# EAGLE design badge (EAGLE 5.11)
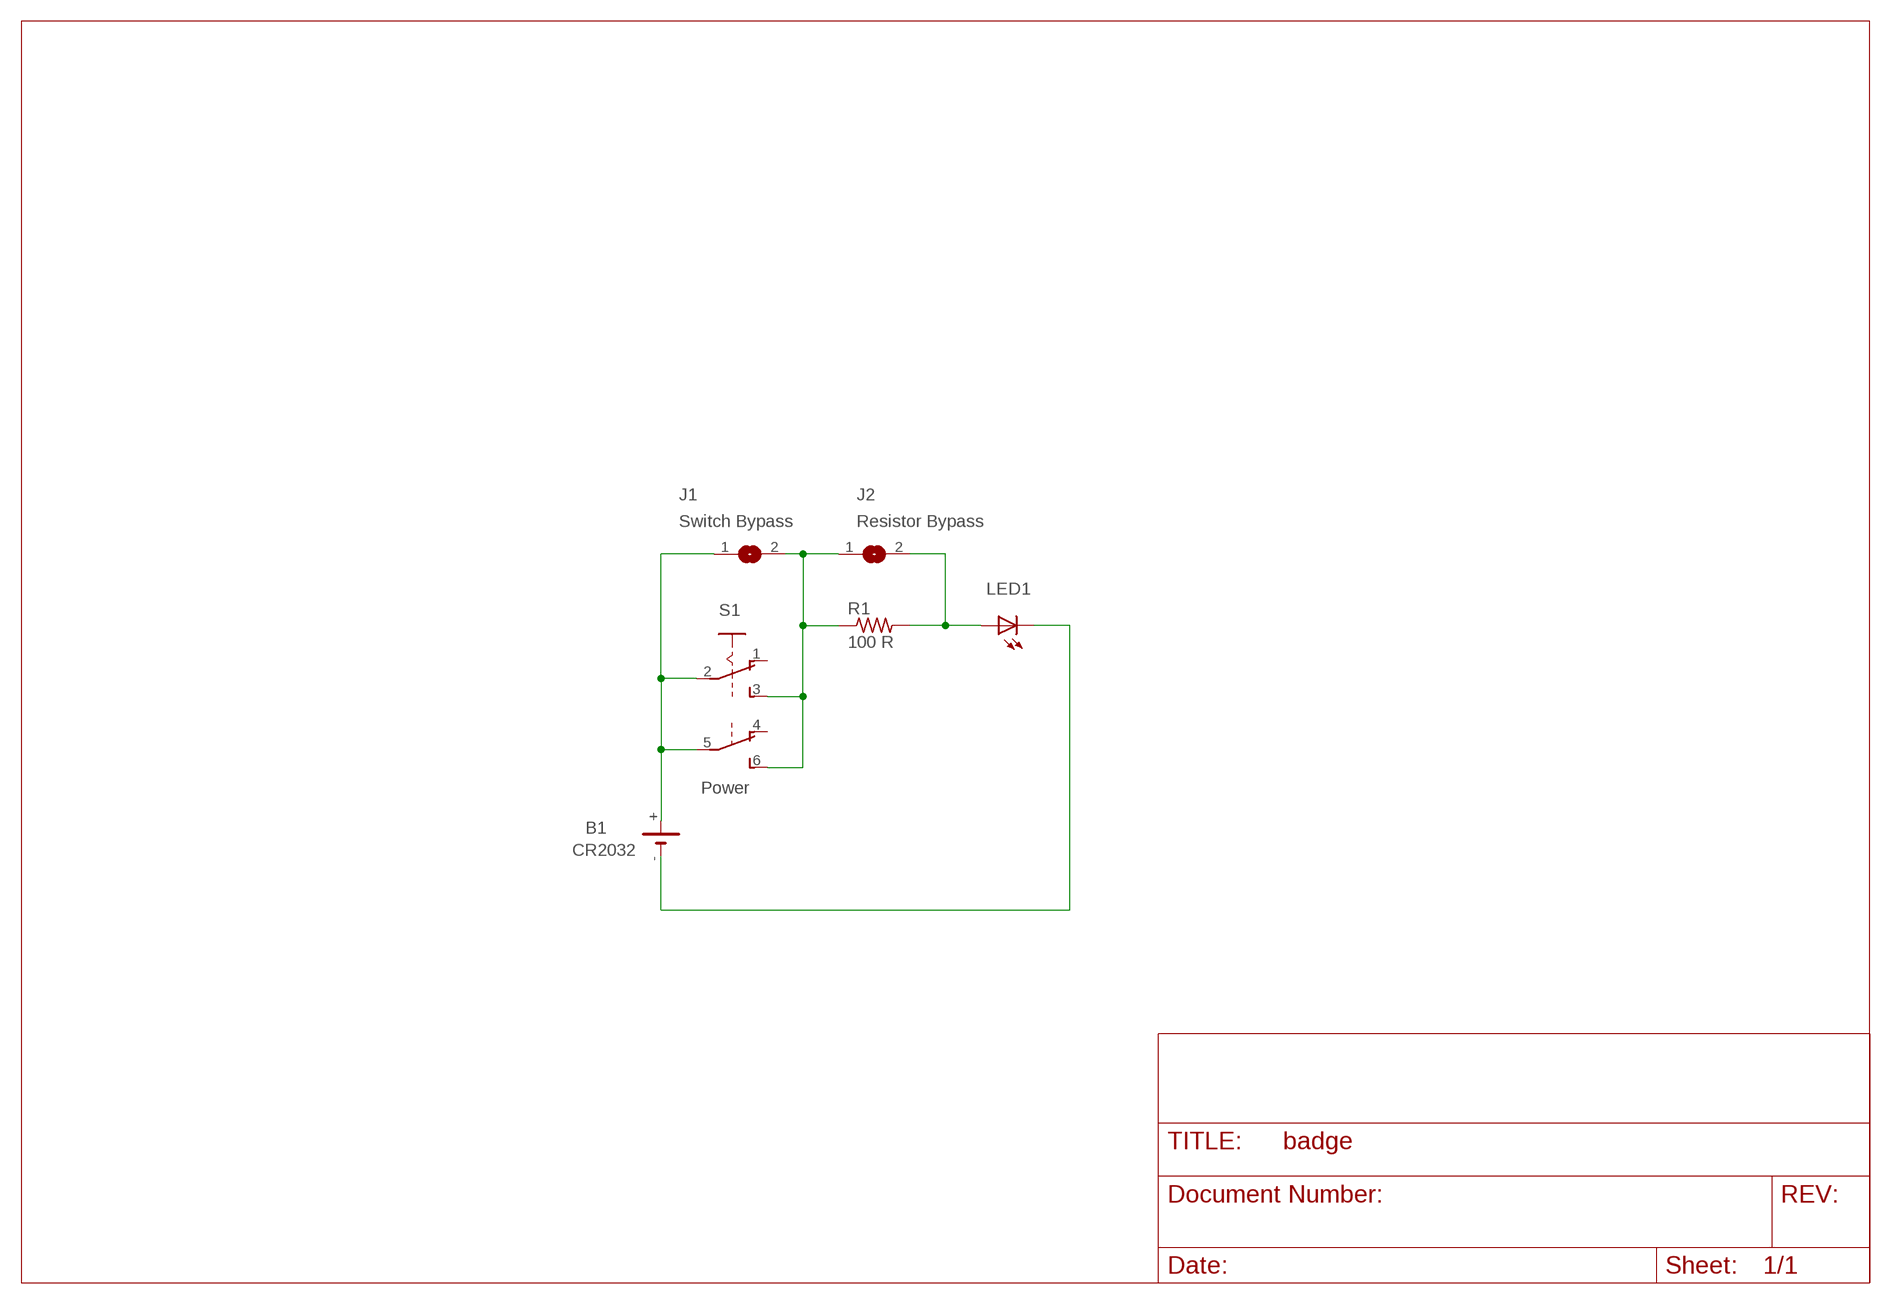
[diagram p0: schematic, sheet 1]

## Parts
B1  CR2032  B2430UNI  [B2430UNI]
J1  Switch Bypass  SJ  [SJ]
J2  Resistor Bypass  SJ  [SJ]
LED1  LED  LED5MM  [LED5MM]
R1  100 R  R-US_0207/10  [0207/10]
S1  Power  A68-A31  [A68-A31]

## Nets
GND: B1.- B1.-@1(-) LED1.K(C)
J2: J2.2 LED1.A R1.2
N$2: J1.2 J2.1 R1.1 S1.3(A:S) S1.6(B:S)
N$3: B1.+ B1.+@1(+) B1.+@2(+) B1.+@3(+) B1.+@4(+) J1.1 S1.2(A:P) S1.5(B:P)
Unconnected: S1.1(A:O) S1.4(B:O)

## Library data of the parts
B1 = battery:B2430UNI: LI BATTERY
J1 J2 = jumper:SJ: SMD solder JUMPER
LED1 = led:LED: LED OSRAM: - CHIPLED LG R971, LG N971, LY N971, LG Q971, LY Q971, LO R971, LY R971 LH N974, LH R974 LS Q976, LO Q976, LY Q976 LO Q996 - Hyper CHIPLED LW Q18S LB Q993, LB Q99A, LB R99A - SideLED LS A670, LO A670, LY A670, LG A670, LP A670 LB A673, LV A673, LT A673, LW A673 LH A674 LY A675 LS A676, LA A676, LO A676, LY A676, LW A676 LS A679, LY A679, LG A679 - Hyper Micro SIDELED® LS Y876, LA Y876, LO Y876, LY Y876 LT Y87S - SmartLED LW L88C, LW L88S LB L89C, LB L89S, LG L890 LS L89K, LO L89K, LY L89K LS L896, LA L896, LO L896, LY L896 - TOPLED LS T670, LO T670, LY T670, LG T670, LP T670 LSG T670, LSP T670, LSY T670, LOP T670, LYG T670 LG T671, LOG T671, LSG T671 LB T673, LV T673, LT T673, LW T673 LH T674 LS T676, LA T676, LO T676, LY T676, LB T676, LH T676, LSB T676, LW T676 LB T67C, LV T67C, LT T67C, LS T67K, LO T67K, LY T67K, LW E67C LS E67B, LA E67B, LO E67B, LY E67B, LB E67C, LV E67C, LT E67C LW T67C LS T679, LY T679, LG T679 LS T770, LO T770, LY T770, LG T770, LP T770 LB T773, LV T773, LT T773, LW T773 LH T774 LS E675, LA E675, LY E675, LS T675 LS T776, LA T776, LO T776, LY T776, LB T776 LHGB T686 LT T68C, LB T68C - Hyper Mini TOPLED® LB M676 - Mini TOPLED Santana® LG M470 LS M47K, LO M47K, LY M47K Source: http://www.osram.convergy.de LUXEON: - LUMILED® LXK2-PW12-R00, LXK2-PW12-S00, LXK2-PW14-U00, LXK2-PW14-V00 LXK2-PM12-R00, LXK2-PM12-S00, LXK2-PM14-U00 LXK2-PE12-Q00, LXK2-PE12-R00, LXK2-PE12-S00, LXK2-PE14-T00, LXK2-PE14-U00 LXK2-PB12-K00, LXK2-PB12-L00, LXK2-PB12-M00, LXK2-PB14-N00, LXK2-PB14-P00, LXK2-PB14-Q00 LXK2-PR12-L00, LXK2-PR12-M00, LXK2-PR14-Q00, LXK2-PR14-R00 LXK2-PD12-Q00, LXK2-PD12-R00, LXK2-PD12-S00 LXK2-PH12-R00, LXK2-PH12-S00 LXK2-PL12-P00, LXK2-PL12-Q00, LXK2-PL12-R00 Source: www.luxeon.com KINGBRIGHT: KA-3528ASYC Source: www.kingbright.com
R1 = rcl:R-US_: RESISTOR, American symbol
S1 = switch:A68-A31: SLIDING SWITCH Siemens, distributor Buerklin, 11G766

## Board
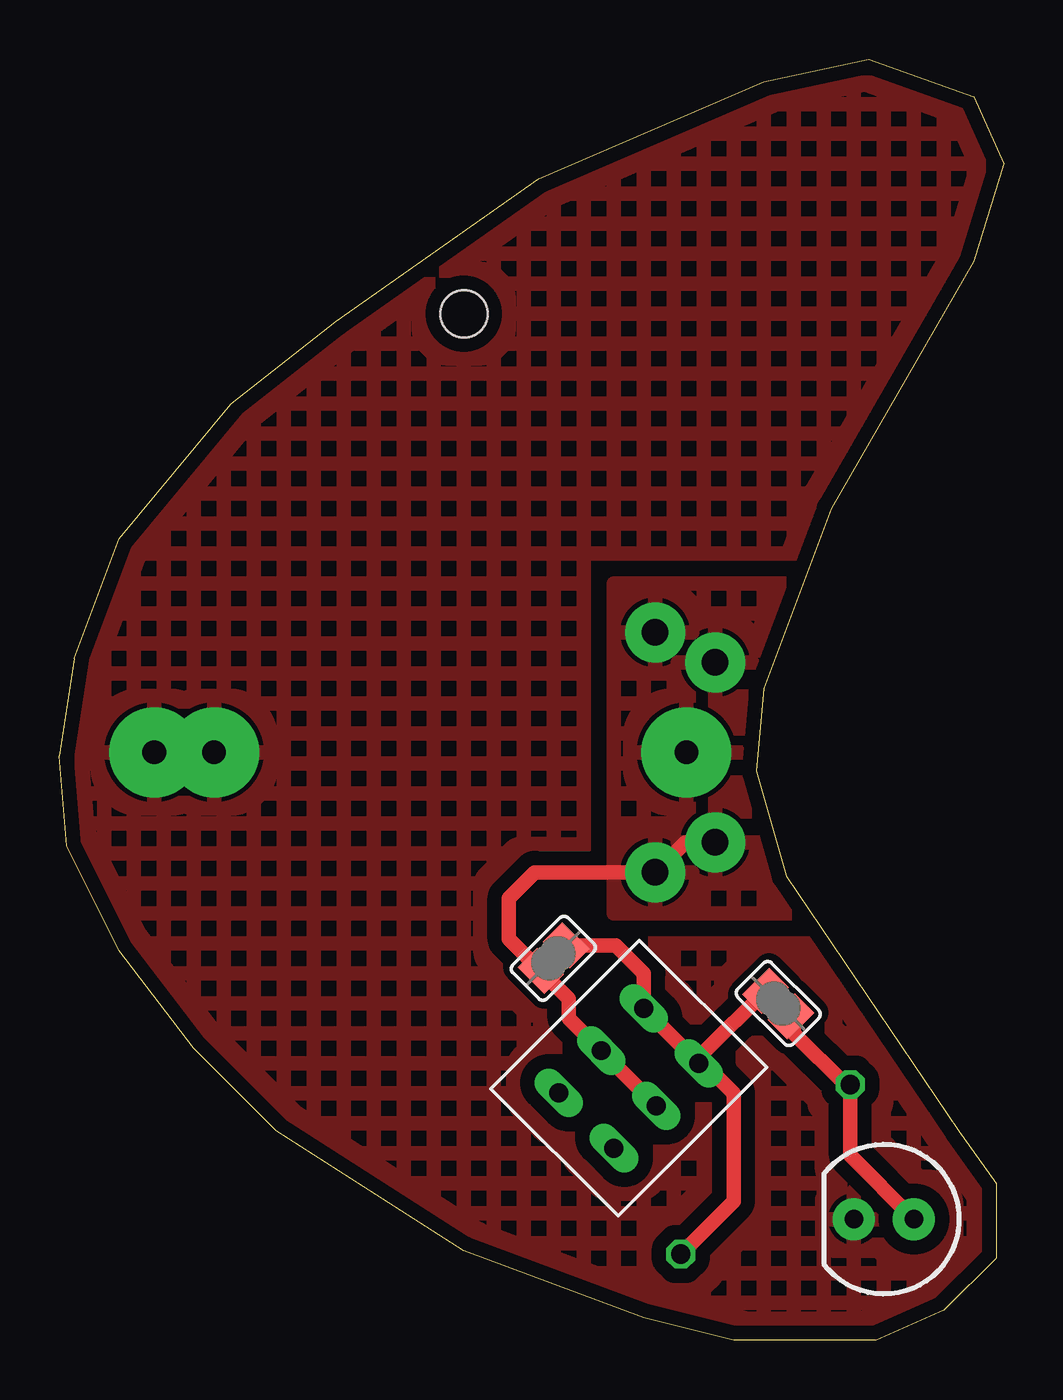
[diagram p1: board, top side]
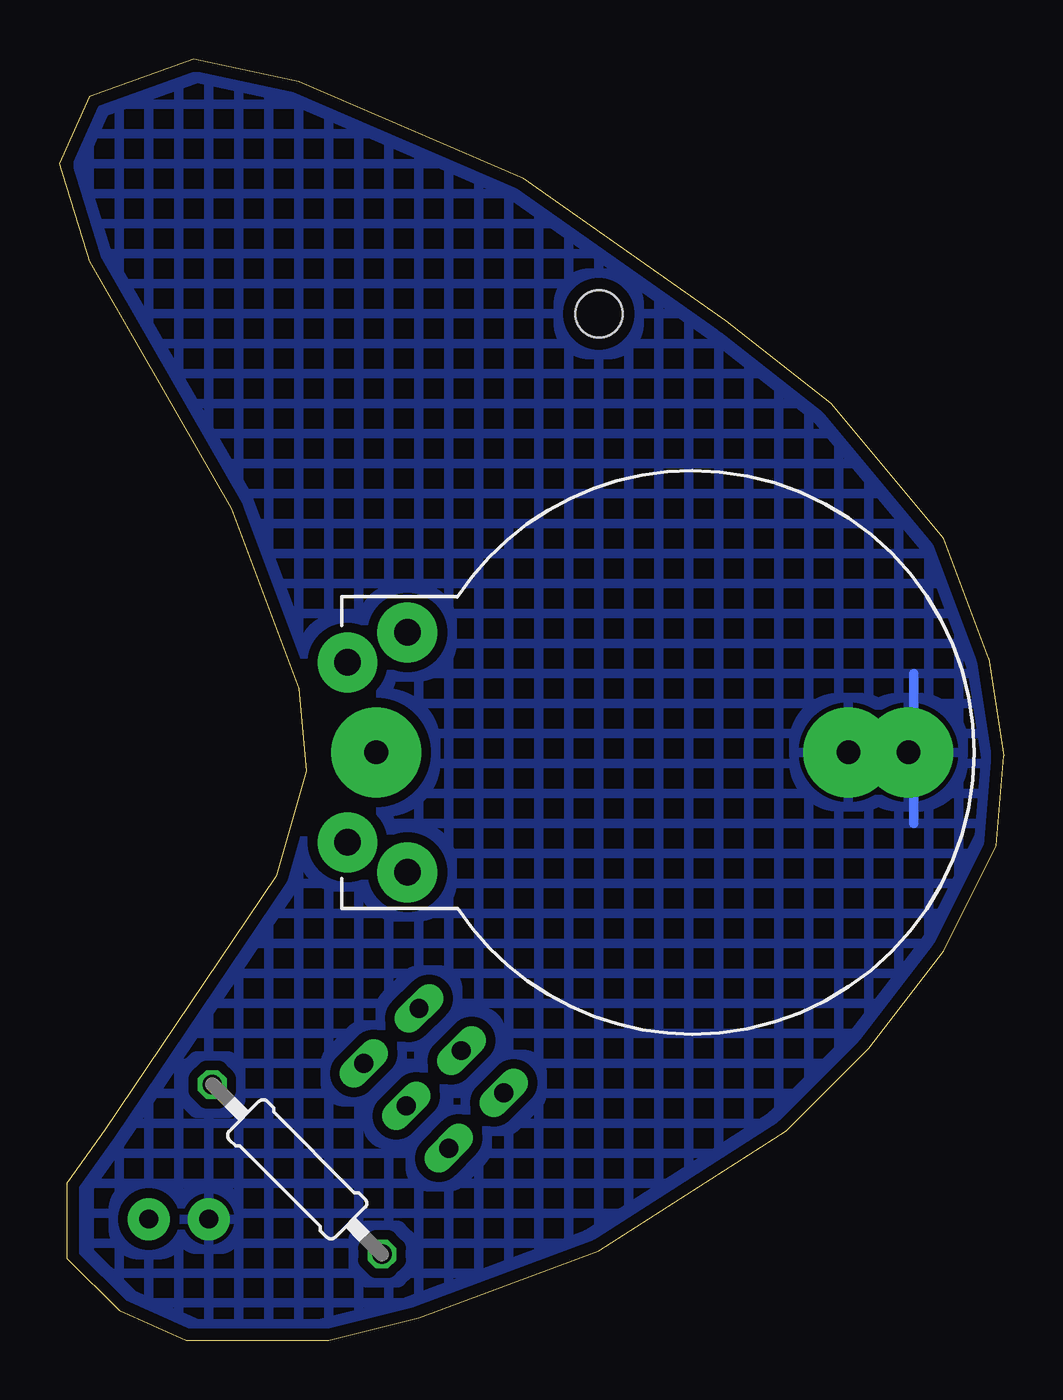
[diagram p2: board, bottom side, seen from below]

Size 40.01 x 54.29 mm. Coordinates in mm from the lower left corner, seen from the top.
Outline: 0.63,28.89 2.54,33.97 7.3,39.69 11.75,43.18 20.32,49.21 29.84,53.34 34.29,54.29 38.73,52.71 40.01,49.85 38.73,45.72 32.7,35.24 29.84,27.62 29.53,24.13 30.8,19.69 38.1,8.89 39.69,6.67 39.69,3.49 37.47,1.27 34.61,0 28.58,0 24.77,0.95 17.15,3.81 9.21,8.89 5.72,12.38 2.54,16.51 0.32,20.96 0,24.77 0.63,28.89
Copper layers (1*16): Top 0.035mm / dielectric 1.5mm / Bottom 0.035mm
Design rules "PCBCart-Standard": minimum track width 8mil, minimum drill 0.4mm, track to track 8mil, track to pad 8mil, pad to pad 8mil, via to via 8mil, smd to smd 8mil, copper to edge 20mil, drill to drill 8mil, minimum pad ring 8mil, minimum via ring 10mil, stop-mask expansion 3mil, vias tented up to drill 0mil, thermal gap 8mil
Holes 2 mm at 17.15,43.5

### Footprints (pad centres in the part's own frame; a part is rotated, then mirrored left to right if it is on the bottom)
B2430UNI = drill 1.118 pad 2.54 round: + 3.81,14.605; +@1 -3.81,14.605; +@2 -5.08,12.065; +@3 5.08,12.065 | drill 1 pad 3.81 round: +@4 0,13.389; - 0,-6.611; -@1 0,-9.151
SJ = smd 1.168 x 1.6: 1 -0.762,0; 2 0.762,0
LED5MM = drill 0.8 pad 1.778 round: A -1.27,0; K 1.27,0
0207/10 = drill 0.813 octagon: 1 -5.08,0; 2 5.08,0
A68-A31 = drill 0.8 long: 1 -2.54,-1.651; 2 0,-1.651; 3 2.54,-1.651; 4 -2.54,1.651; 5 0,1.651; 6 2.54,1.651

### Placement (x,y rotation side)
B1  13.18,24.92 90 bottom
J1  20.94,16.2 45 top
J2  30.46,14.27 315 top
LED1  34.94,5.14 180 top
R1  29.92,7.25 135 bottom
S1  24.13,11.11 45 top

### Tracks (layer width: path | path; a pad name or v marks a point on that pad's centre or on a via)
GND
  Bottom 0.406: 3.81,21.91 3.81,28.26
  pour Bottom (isolate 0.406, hatched): -1.9,-2.22 -1.9,56.2 41.91,56.2 41.91,-2.22
  pour Top (isolate 0.61, hatched): -1.27,-1.59 -1.27,55.56 41.28,55.56 41.28,33.34 22.23,33.34 22.23,16.83 41.28,16.83 41.28,-1.59
J2
  Top 0.61: LED1.A 33.51,7.84 R1.2 33.29,10.84 31.12,13.02 31.12,13.62 J2.2
N$2
  Top 0.61: 27.31,11.74 S1.3 S1.6 24.77,15.56 23.59,16.73 J1.2 | 27.31,11.74 28.58,10.48 28.58,5.91 R1.1 | 27.31,11.74 27.31,12.2 J2.1
N$3
  Top 0.61: S1.5 S1.2 | S1.5 | S1.5 21.59,13.65 21.59,14.46 J1.1 19.05,17 19.05,18.73 20.16,19.84 B1.+@2 26.52,21.11 B1.+@1
  pour Top (isolate 0.61, hatched): 23.5,32.07 32.39,32.07 32.39,18.1 23.5,18.1

### Text on the board
tValues: Mini Maker Faire Melbourne 2012 | www.hackmelbourne.org/faire | SWITCH | BYPASS | ON | BYPASS | RESISTOR | OFF | + | LED
bValues: Badge design by Luke Weston, 2011 | CR 2032 3V Li coin cell | + side up